# Altium schematic sheet [03] - BLOCK DIAGRAM.SchDoc: BLOCK DIAGRAM
size 433 x 279 mm; Author: ZAG; DrawnBy: ZAG; SheetNumber: 3; SheetTotal: n; PageSetup: Record=PageOptions|CenterHorizontal=True|CenterVertical=True|PrintScale=0.96|XCorrection=1.00|YCorrection=1.00|PrintKind=2|BorderSize=5000000|LeftOffset=0|BottomOffset=0|Orientation=2|PaperLength=4318|PaperWidth=2794|Scale=100|PaperSource=15|PrintQuality=600|MediaType=1|DitherType=10|PaperKind=11x17|PrintScaleMode=1; SchRevision: 01; PCBRevision: 01; Project: TEMPLATE; SchStatus: PRELIMINARY
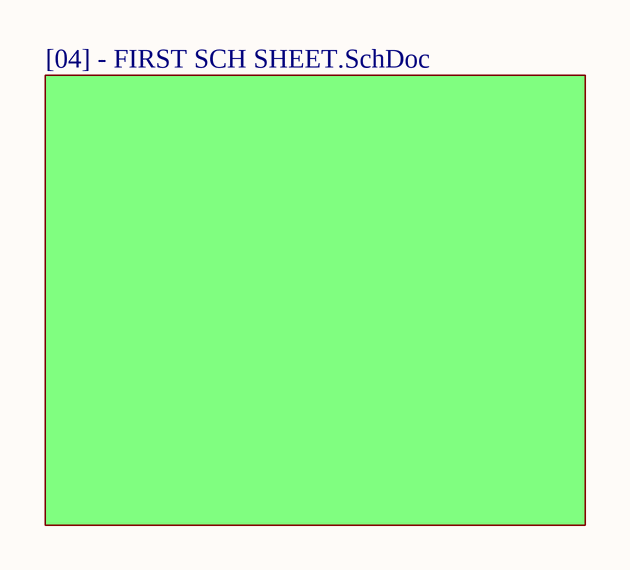
[diagram p0: [03] - BLOCK DIAGRAM.SchDoc]

## Sub-sheets
Designator = [04] - FIRST SCH SHEET.SchDoc: no entries

## Notes on the sheet
- SHEET TITLE
- SCH REV:
- PROJECT NAME
- PCB REV:
- DATE:
- DRAWN BY
- CONTACT
- MANUFACTURER, OR SALE OF PROCESSES OR PRODUCTS WITHOUT THE EXPRESSED WRITTEN CONSENT OF
- THE INFORMATION CONTAINED HEREIN IS DEEMED TO BE CONFIDENTIAL, PROPRIETARY, AND A TRADE SECRET OF
- THIS INFORMATION MAY NOT BE USED, REPRODUCED, OR DISCLOSED AS THE DIRECT OR INDIRECT BASIS FOR THE DEVELOPMENT,
- SHEET
- MULE LABS, LLC
- www.mule-labs.com <http://www.mule-labs.com>
- OF
- SIZE: B
- DO NOT SCALE DRAWING